# EAGLE design fingertip_20line_2 (EAGLE 9.6.2)
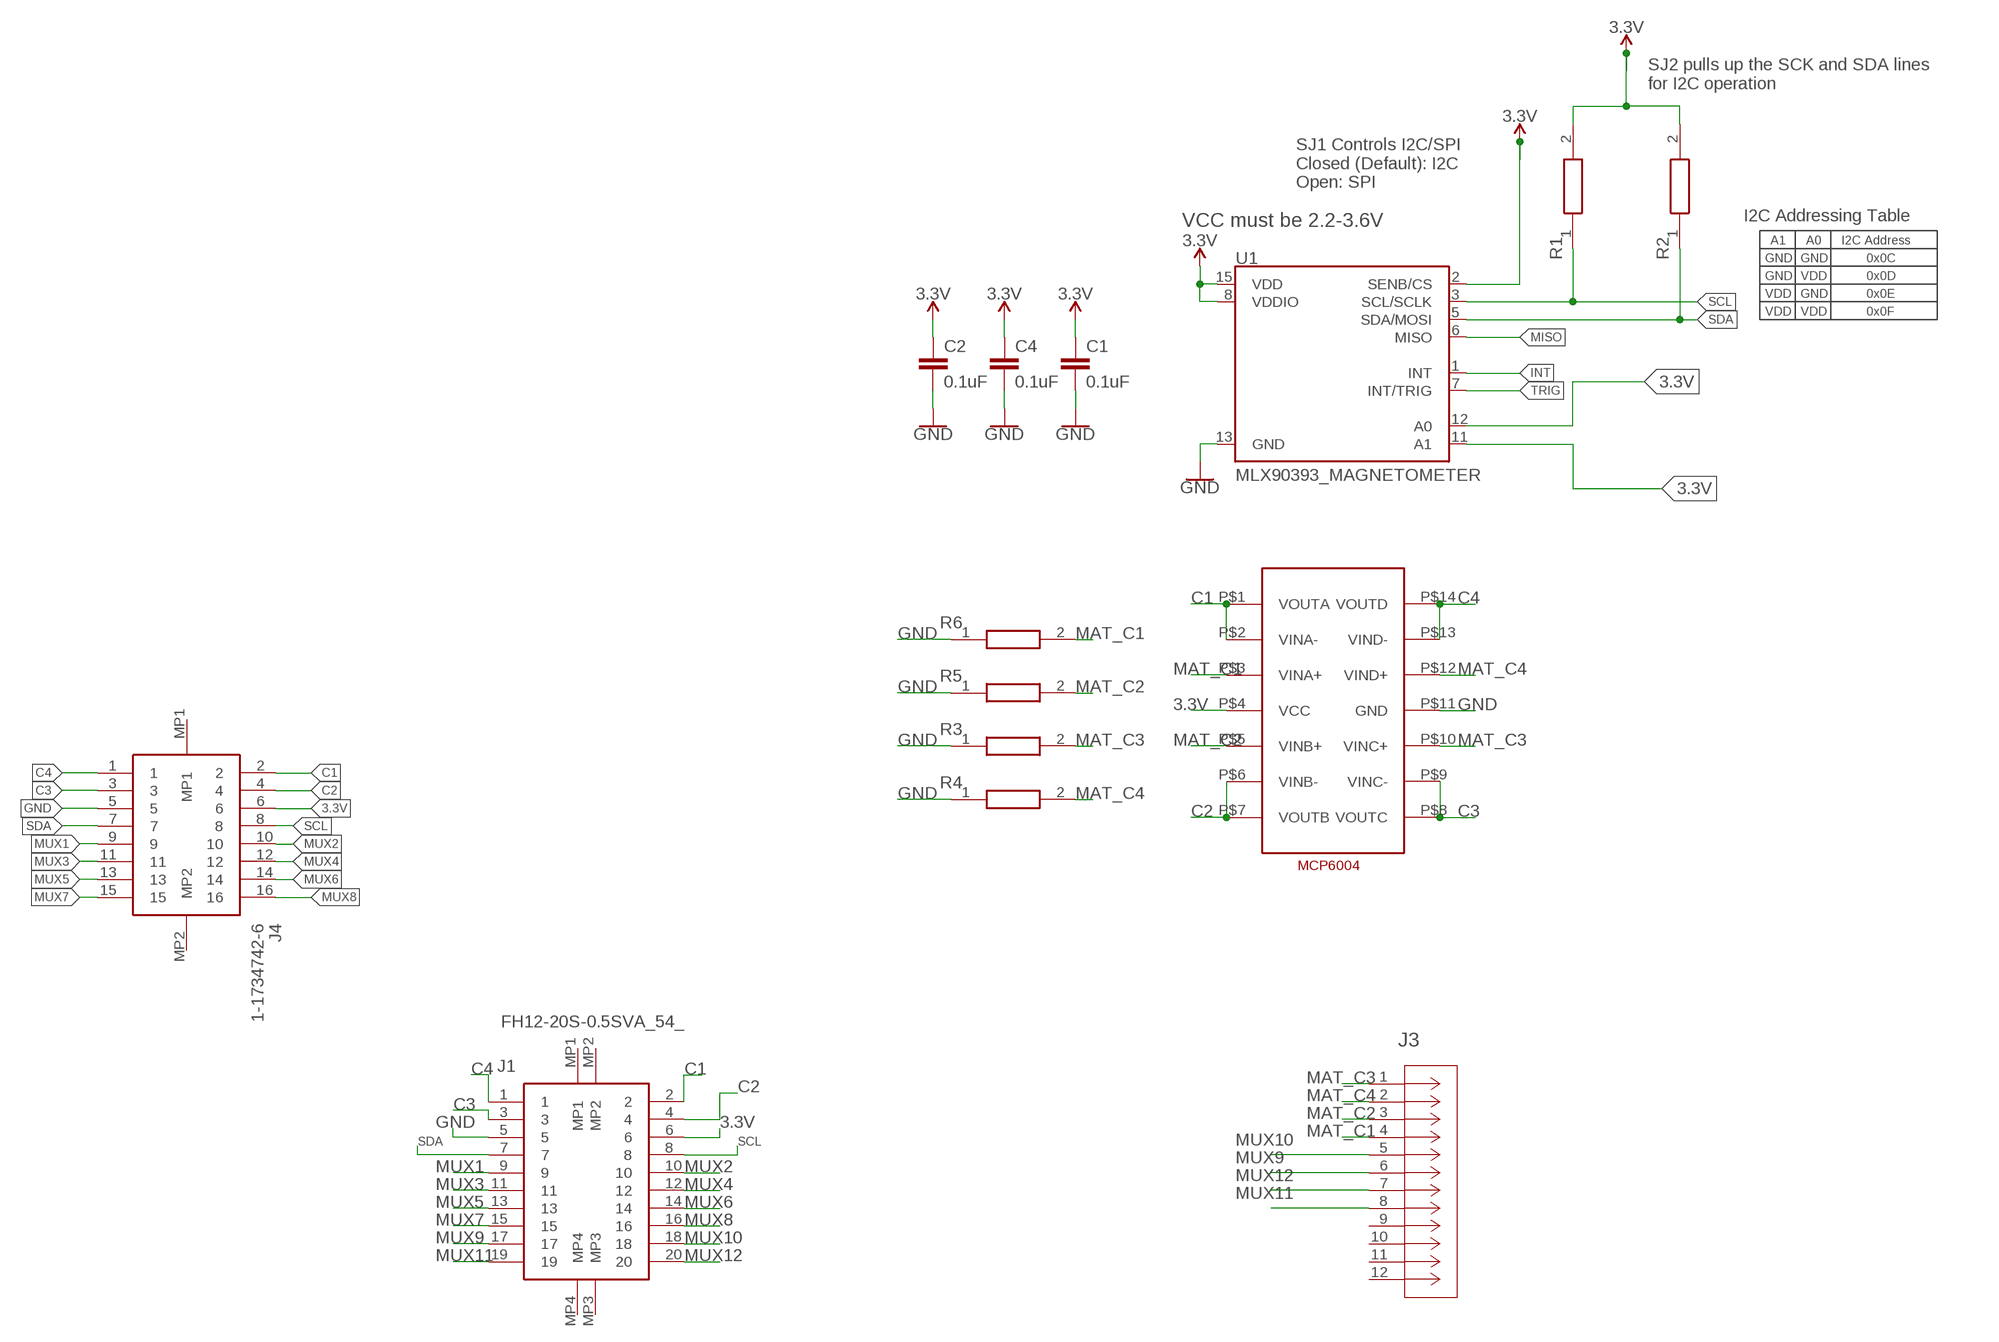
[diagram p0: schematic, sheet 1]

## Parts
C1  0.1uF  0.1UF-0603-25V-(+80/-20%)  [0603]
C2  0.1uF  0.1UF-0603-25V-(+80/-20%)  [0603]
C4  0.1uF  0.1UF-0603-25V-(+80/-20%)  [0603]
J1  FH12-20S-0.5SVA_54_  [FH1220S05SVA54]
J3  FH12-8S-1SV(55)  [CON8_1X8_DUTB1_HRS_HIR]
J4  1-1734742-6  [117347426]
R1  ERJ-S02J103X  [RESC1005X40N]
R2  ERJ-S02J103X  [RESC1005X40N]
R3  ERJ-S02J103X  [RESC1005X40N]
R4  ERJ-S02J103X  [RESC1005X40N]
R5  ERJ-S02J103X  [RESC1005X40N]
R6  ERJ-S02J103X  [RESC1005X40N]
U1  MLX90393_MAGNETOMETER  [QFN-16_WITH_AXIES]
U$2  DECADE-MCP6004  [DECADE-MCP6003]

## Nets
3.3V: C1.1 C2.1 C4.1 J1.6 J4.6 R1.2 R2.2 U1.2(SENB/CS) U1.8(VDDIO) U1.11(A1) U1.12(A0) U1.15(VDD) U$2.P$4(VCC)
C1: J1.2 J4.2 U$2.P$1(VOUTA) U$2.P$2(VINA-)
C2: J1.4 J4.4 U$2.P$6(VINB-) U$2.P$7(VOUTB)
C3: J1.3 J4.3 U$2.P$8(VOUTC) U$2.P$9(VINC-)
C4: J1.1 J4.1 U$2.P$13(VIND-) U$2.P$14(VOUTD)
GND: C1.2 C2.2 C4.2 J1.5 J4.5 R3.1 R4.1 R5.1 R6.1 U1.13(GND) U$2.P$11(GND)
INT: U1.1(INT)
MAT_C1: J3.4 R6.2 U$2.P$3(VINA+)
MAT_C2: J3.3 R5.2 U$2.P$5(VINB+)
MAT_C3: J3.1 R3.2 U$2.P$10(VINC+)
MAT_C4: J3.2 R4.2 U$2.P$12(VIND+)
MISO: U1.6(MISO)
MUX1: J1.9 J4.9
MUX2: J1.10 J4.10
MUX3: J1.11 J4.11
MUX4: J1.12 J4.12
MUX5: J1.13 J4.13
MUX6: J1.14 J4.14
MUX7: J1.15 J4.15
MUX8: J1.16 J4.16
MUX9: J1.17 J3.6
MUX10: J1.18 J3.5
MUX11: J1.19 J3.8
MUX12: J1.20 J3.7
SCL: J1.8 J4.8 R1.1 U1.3(SCL/SCLK)
SDA: J1.7 J4.7 R2.1 U1.5(SDA/MOSI)
TRIG: U1.7(INT/TRIG)
Unconnected: J1.MP1 J1.MP2 J1.MP3 J1.MP4 J3.9 J3.10 J3.11 J3.12 J4.MP1 J4.MP2

## Notes on the sheet
- SJ2 pulls up the SCK and SDA lines
  for I2C operation
- SJ1 Controls I2C/SPI
  Closed (Default): I2C
  Open: SPI
- VCC must be 2.2-3.6V
- I2C Addressing Table
- A1 | A0 | I2C Address
- GND | GND | 0x0C
- GND | VDD | 0x0D
- VDD | GND | 0x0E
- VDD | VDD | 0x0F

## Library data of the parts
C1 C2 C4 = SparkFun-Capacitors:0.1UF: 0.1µF ceramic capacitors A capacitor is a passive two-terminal electrical component used to store electrical energy temporarily in an electric field.; PROD_ID: CAP-00810
J1 = FH12-20S-0.5SVA_54_:FH12-20S-0.5SVA_54_: Hirose FH12 0.5mm Pitch 20 Way SMT Female FPC Connector, ZIF Vertical Contact Source: Datasheet <http://uk.rs-online.com/web/p/products/1760102P>; DESCRIPTION: Hirose FH12 0.5mm Pitch 20 Way SMT Female FPC Connector, ZIF Vertical Contact; HEIGHT: 5.7mm; MANUFACTURER_NAME: Hirose; MANUFACTURER_PART_NUMBER: FH12-20S-0.5SVA(54); RS_PART_NUMBER: 1760102P; RS_PRICE-STOCK: http://uk.rs-online.com/web/p/products/1760102P
J3 = my-library:FH12-8S-1SV(55); BUILT_BY: EMA_Kyle; COPYRIGHT: Copyright (C) 2018 Accelerated Designs. All rights reserved; MANUFACTURER_PART_NUMBER: FH12-8S-1SV(55); SOURCELIBRARY: Hirose_2008-01-01; VENDOR: Hirose
J4 = SamacSys_Parts:1-1734742-6: TE CONNECTIVITY - 1-1734742-6 - CONNECTOR, FFC / FPC, 0.5MM, 16WAY Source: Datasheet <https://www.te.com/commerce/DocumentDelivery/DDEController?Action=showdoc&DocId=Customer Drawing1734742PpdfEnglishENG_CD_1734742_P.pdf1-1734742-6>; DESCRIPTION: TE CONNECTIVITY - 1-1734742-6 - CONNECTOR, FFC / FPC, 0.5MM, 16WAY; HEIGHT: 5.3mm; MANUFACTURER_NAME: TE Connectivity; MANUFACTURER_PART_NUMBER: 1-1734742-6; MOUSER_PART_NUMBER: 571-1-1734742-6; MOUSER_PRICE-STOCK: https://www.mouser.co.uk/ProductDetail/TE-Connectivity/1-1734742-6?qs=GQ3BsEl46pkEaYiPSkWN4w%3D%3D
R1-R6 = SamacSys_Parts:ERJ-S02J103X: Thick Film Resistors - SMD 0402 10Kohms 5% Anti-Sulfur Source: Datasheet <https://industrial.panasonic.com/cdbs/www-data/pdf/RDP0000/AOA0000C334.pdf>; DESCRIPTION: Thick Film Resistors - SMD 0402 10Kohms 5% Anti-Sulfur; HEIGHT: 0.4mm; MANUFACTURER_NAME: Panasonic; MANUFACTURER_PART_NUMBER: ERJ-S02J103X
U1 = SparkFun-Sensors:MLX90393_MAGNETOMETER; PROD_ID: SEN-13886
U$2 = DECADE-libraries20151104:DECADE-MCP6004

## Board
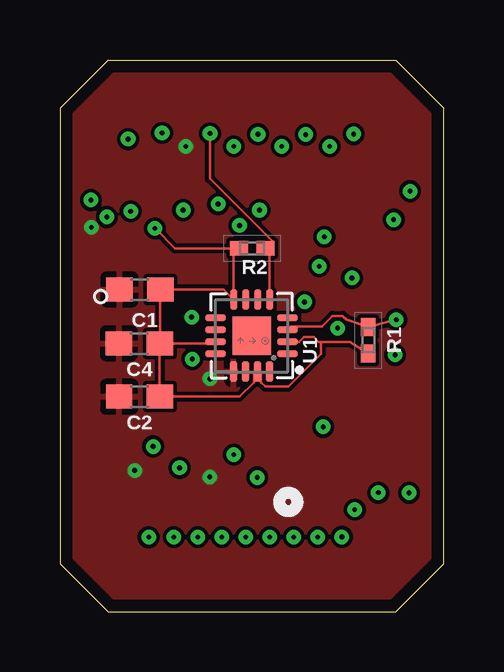
[diagram p1: board, top side]
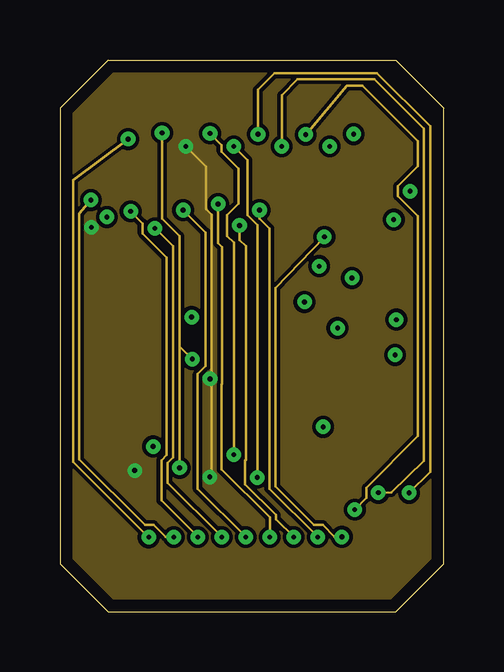
[diagram p2: board, inner layer Route2]
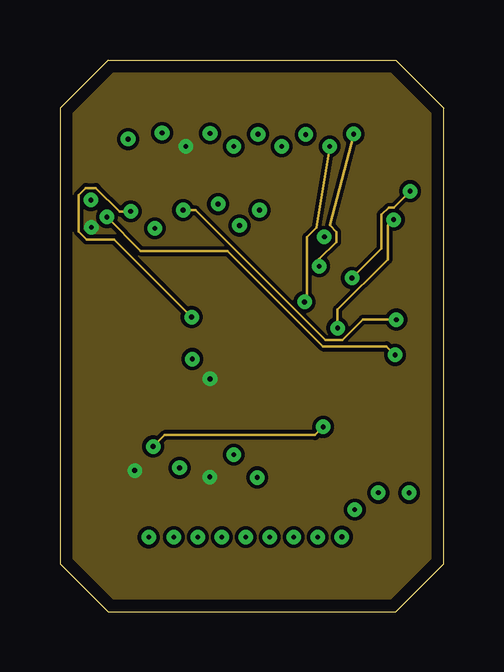
[diagram p3: board, inner layer Route15]
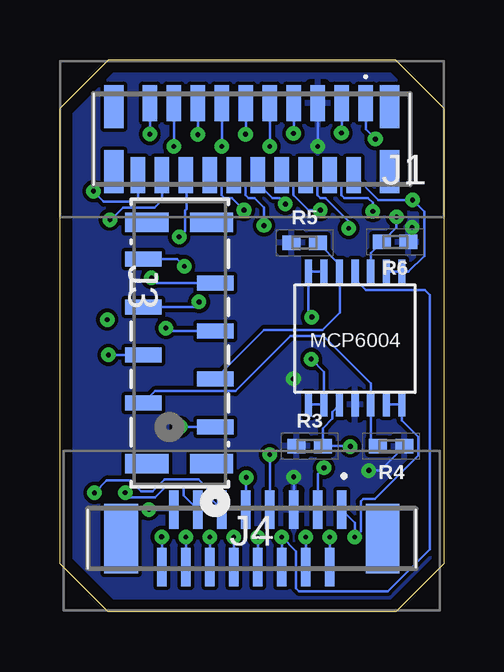
[diagram p4: board, bottom side, seen from below]

Size 16 x 23 mm. Coordinates in mm from the lower left corner, seen from the top.
Outline: 2,23 14,23 16,21 16,2 14,0 2,0 0,2 0,21 2,23
Copper layers (1+2*15+16): Top 0.035mm / dielectric 0.2mm / Route2 0.0175mm / dielectric 1.065mm / Route15 0.0175mm / dielectric 0.2mm / Bottom 0.035mm
Design rules "default *": minimum track width 0.1mm, minimum drill 0.2mm, track to track 6mil, track to pad 6mil, pad to pad 6mil, via to via 6mil, smd to smd 6mil, copper to edge 20mil, drill to drill 6mil, minimum pad ring 10mil, minimum via ring 8mil, stop-mask expansion 4mil, vias tented up to drill 0mil, thermal gap 10mil

### Footprints (pad centres in the part's own frame; a part is rotated, then mirrored left to right if it is on the bottom)
0603 = smd 1.1 x 1: 1 -0.85,0; 2 0.85,0
FH1220S05SVA54 = smd 0.6 x 1.5: 1 4.75,1.5; 2 4.25,-1.5; 3 3.75,1.5; 4 3.25,-1.5; 5 2.75,1.5; 6 2.25,-1.5; 7 1.75,1.5; 8 1.25,-1.5; 9 0.75,1.5; 10 0.25,-1.5; 11 -0.25,1.5; 12 -0.75,-1.5; 13 -1.25,1.5; 14 -1.75,-1.5; 15 -2.25,1.5; 16 -2.75,-1.5; 17 -3.25,1.5; 18 -3.75,-1.5; 19 -4.25,1.5; 20 -4.75,-1.5 | smd 0.8 x 1.8: MP1 5.75,1.35; MP2 5.75,-1.35; MP3 -5.75,-1.35; MP4 -5.75,1.35
CON8_1X8_DUTB1_HRS_HIR = smd 0.61 x 1.524: 1 3.5,1.473; 2 2.5,-1.524; 3 1.5,1.473; 4 0.5,-1.524; 5 -0.5,1.473; 6 -1.5,-1.524; 7 -2.5,1.473; 8 -3.5,-1.524 | smd 0.813 x 1.803: 9 -5.029,-1.372; 10 5.029,-1.372; 11 -5.029,1.321; 12 5.029,1.321
117347426 = smd 0.4 x 1.6: 1 -3.75,-1.2; 2 -3.25,1.2; 3 -2.75,-1.2; 4 -2.25,1.2; 5 -1.75,-1.2; 6 -1.25,1.2; 7 -0.75,-1.2; 8 -0.25,1.2; 9 0.25,-1.2; 10 0.75,1.2; 11 1.25,-1.2; 12 1.75,1.2; 13 2.25,-1.2; 14 2.75,1.2; 15 3.25,-1.2; 16 3.75,1.2 | smd 1.4 x 2.9: MP1 -5.45,0; MP2 5.45,0
RESC1005X40N = smd 0.75 x 0.6: 1 -0.55,0; 2 0.55,0
QFN-16_WITH_AXIES = smd 0.3 x 0.85: 1 0.754,1.498; 2 0.254,1.498; 3 -0.246,1.498; 4 -0.746,1.498; 9 -0.746,-1.506; 10 -0.246,-1.506; 11 0.254,-1.506; 12 0.754,-1.506 | smd 0.85 x 0.3: 5 -1.508,0.746; 6 -1.508,0.246; 7 -1.508,-0.254; 8 -1.508,-0.754; 13 1.496,-0.764; 14 1.496,-0.264; 15 1.496,0.236; 16 1.496,0.736 | smd 1.6 x 1.6: 17 0,0
DECADE-MCP6003 = smd 1 x 0.3: P$1 2.75,-2.05; P$2 2.75,-1.4; P$3 2.75,-0.75; P$4 2.75,-0.1; P$5 2.75,0.55; P$6 2.75,1.2; P$7 2.75,1.85; P$8 -2.8,1.85; P$9 -2.8,1.2; P$10 -2.8,0.55; P$11 -2.8,-0.1; P$12 -2.8,-0.75; P$13 -2.8,-1.4; P$14 -2.8,-2.05

### Placement (x,y rotation side)
C1  3.33,13.43 180 top
C2  3.32,8.96 180 top
C4  3.31,11.18 180 top
J1  8,19.7 0 bottom
J3  11,11.2 270 bottom
J4  8,3.05 180 bottom
R1  12.86,11.32 270 top
R2  8.02,15.14 180 top
R3  5.59,6.9 0 bottom
R4  2.18,6.89 180 bottom
R5  5.8,15.38 0 bottom
R6  2.02,15.41 180 bottom
U1  8,11.5 270 top
U$2  3.79,11.43 90 bottom

### Tracks (layer width: path | path; a pad name or v marks a point on that pad's centre or on a via)
3.3V  (via drill 0.2)
  Top 0.102: R1.2 12.08,11.25 10.89,11.25 | U1.2 9.97,11.25 10.17,11.45 10.59,11.45 10.79,11.25 10.89,11.25 | 10.89,11.25 10.88,11.24 10.88,10.73 9.53,9.38 8.57,9.38 8.38,9.56 8.38,9.86 U1.15 8.09,9.86 8.09,9.56 7.49,8.96 C2.1 C4.1 | U1.12 U1.11 6.43,11.18 C4.1 | v3.96,15.98 4.8,15.14 R2.2 7.25,14.92 U1.8 6.82,13.43 C1.1 4.18,11.2 C4.1
  Route2 0.102: v6.75,3.11 4.48,5.37 4.48,6.2 4.71,6.43 4.71,15.23 v3.96,15.98
  Bottom 0.1: U$2.P$4 3.69,13.87 3.23,13.41 0.78,13.41 0.56,13.19 0.56,2.6 2.32,0.85 6.03,0.85 6.15,0.97 6.15,2.51 v6.75,3.11
  Bottom 0.102: J1.6 5.25,17.7 5.25,17.37 5.13,17.25 4.93,17.25 3.96,16.28 v3.96,15.98 | J4.6 v6.75,3.11
C1  (via drill 0.2)
  Route2 0.1: v4.75,3.11 4.42,3.11 3.92,3.61 3.56,3.61 0.81,6.35 0.81,16.59 v1.29,17.16
  Bottom 0.102: J1.2 2.71,17.16 v1.29,17.16 0.81,16.68 0.81,14.83 1.46,14.18 U$2.P$1 U$2.P$2 | J4.2 v4.75,3.11
C2  (via drill 0.2)
  Route2 0.102: v5.75,3.11 4.23,4.63 4.23,6.31 4.46,6.54 4.46,14.77 3.45,15.77 3.45,16.18 v2.95,16.69
  Route15 0.102: v5.5,12.28 2.26,15.51 1.11,15.51 0.78,15.84 0.78,17.37 1.08,17.67 1.5,17.67 2.48,16.69 v2.95,16.69
  Bottom 0.102: J1.4 4.25,17.7 4.25,17.37 4.13,17.25 3.16,17.25 2.95,17.04 v2.95,16.69 | J4.4 v5.75,3.11 | U$2.P$6 U$2.P$7 5.64,12.42 v5.5,12.28
C3  (via drill 0.2)
  Route2 0.1: v4.26,19.96 4.26,16.39 4.99,15.66 4.99,11.08 v4.99,5.99
  Route2 0.102: v5.52,10.53 4.99,11.06 4.99,11.08
  Bottom 0.102: J1.3 v4.25,19.97 v4.26,19.96 | J4.3 5.25,5.73 v4.99,5.99 | U$2.P$8 U$2.P$9 4.99,10 v5.52,10.53
C4  (via drill 0.2)
  Route2 0.1: v3.71,3.1 0.56,6.25 0.56,17.99 v2.84,19.7
  Bottom 0.102: J1.1 3.25,20.11 v2.84,19.7 | J4.1 3.71,3.71 v3.71,3.1 3.45,3.35 3.45,4.58 3.33,4.7 2.85,4.7 1.05,6.51 1.05,7.27 1.74,7.96 U$2.P$14 U$2.P$13
GND  (via drill 0.2)
  Top 0.102: U1.13 6.56,10 v6.26,9.7
  Route2 0.102: v6.25,5.61 6.33,5.69 6.33,16.55 6.09,16.79 6.09,18.55 v5.25,19.39
  Bottom 0.1: v6.25,5.61 J4.5
  Bottom 0.102: J1.5 v5.25,19.39 | R6.1 1.32,15.56 v1.32,16.02 | R4.1 2.64,5.88 v3.12,5.88
  pour Bottom: -0.29,23.76 -0.29,-0.74 16.28,-0.74 16.28,23.76
  pour Top: -0.48,24.04 16.55,24.04 16.55,-0.78 -0.48,-0.78
  pour Route2: -0.32,23.93 -0.39,-0.79 16.18,-0.65 16.41,23.9
  pour Route15: -0.35,23.76 -0.32,-0.53 16.39,-0.49 16.46,23.77
MAT_C1  (via drill 0.2)
  Route15 0.102: v1.96,16.45 3.37,15.04 7,15.04 10.98,11.06 13.62,11.06 v13.98,10.7
  Bottom 0.102: U$2.P$3 3.04,14.94 R6.2 1.96,16.02 v1.96,16.45 | J3.4 v13.98,10.7
MAT_C2
  Bottom 0.102: R5.2 4.34,14.47 U$2.P$5 4.33,14.17 4.33,12.47 5.05,11.74 7.49,11.74 J3.3
MAT_C3  (via drill 0.2)
  Route15 0.102: v10.98,7.7 10.64,7.36 4.37,7.36 v3.89,6.88
  Bottom 0.102: U$2.P$10 4.64,8.33 4.64,8.05 5.04,7.64 R3.2 3.91,6.9 v3.89,6.88 | J3.1 v10.98,7.7
MAT_C4
  Bottom 0.102: R4.2 3.04,7.2 U$2.P$12 3.04,9.51 5.02,11.49 6.39,11.49 8.68,9.19 12.03,9.19 J3.2
MUX1  (via drill 0.2)
  Route2 0.102: v8.23,5.59 8.23,16.12 7.82,16.53 7.82,18.83 v7.25,19.39
  Bottom 0.1: J4.9 v8.23,5.59
  Bottom 0.102: J1.9 v7.25,19.39
MUX2  (via drill 0.2)
  Route2 0.102: v6.6,16.99 6.6,15.36 6.77,15.19 6.77,9.49 6.74,9.47 6.74,5.93 8.75,3.92 v8.75,3.11
  Bottom 0.102: v6.6,16.99 6.85,17.25 7.13,17.25 7.75,17.86 J1.10 | J4.10 v8.75,3.11
MUX3  (via drill 0.2)
  Route2 0.102: v8.26,19.9 8.26,21.76 8.94,22.44 13.23,22.44 15.44,20.23 15.44,5.83 v14.56,4.95
  Bottom 0.102: J1.11 v8.25,19.91 v8.26,19.9 | J4.11 9.85,4.85 9.85,5.13 10.22,5.51 11.64,5.51 12.14,5.01 12.62,5.01 13.07,5.46 14.05,5.46 v14.56,4.95
MUX4  (via drill 0.2)
  Route2 0.102: v9.75,3.11 9,3.85 9,4.03 7.72,5.31 7.72,6.3 7.76,6.33 7.76,15.23 7.49,15.5 v7.49,16.1
  Bottom 0.102: J1.12 8.25,17.7 8.25,17.37 8.13,17.25 7.89,17.25 7.49,16.85 v7.49,16.1 | J4.12 v9.75,3.11
MUX5  (via drill 0.2)
  Route2 0.1: v9.25,19.39 9.25,21.53 9.91,22.19 13.12,22.19 15.19,20.12 15.19,6.29 13.83,4.97 v13.28,4.96
  Bottom 0.102: J1.13 v9.25,19.39 | J4.13 10.85,4.85 10.85,5.13 10.97,5.25 11.53,5.25 12.03,4.76 13.08,4.76 v13.28,4.96
MUX6  (via drill 0.2)
  Route2 0.102: v8.32,16.74 8.32,16.38 8.74,15.97 8.74,5.12 v10.75,3.11
  Bottom 0.102: J1.14 9.25,17.7 9.25,17.37 9.13,17.25 8.83,17.25 v8.32,16.74 | J4.14 v10.75,3.11
MUX7  (via drill 0.2)
  Route2 0.1: v12.29,4.25 12.77,4.73 12.77,5.17 14.93,7.33 14.93,16.49 14.1,17.32 14.1,17.74 14.93,18.57 14.93,19.62 12.62,21.94 11.96,21.94 v10.25,19.89
  Bottom 0.102: J1.15 v10.25,19.89 | J4.15 v12.29,4.25
MUX8  (via drill 0.2)
  Route2 0.1: v11.76,3.11 11.46,3.11 10.96,3.61 10.6,3.61 8.99,5.22 8.99,13.49 v11.03,15.62
  Bottom 0.102: J1.16 10.73,18.18 10.73,16.78 10.78,16.72 10.78,15.86 v11.03,15.62 | J4.16 v11.75,3.11 v11.76,3.11
MUX9  (via drill 0.2)
  Route15 0.1: v11.25,19.39 10.7,16.02 10.3,15.62 10.3,13.01 v10.2,12.91
  Bottom 0.102: J1.17 v11.25,19.39 | J3.6 10.41,12.7 v10.2,12.91
MUX10  (via drill 0.2)
  Route15 0.1: v13.92,16.34 13.67,16.09 13.67,14.68 11.58,12.6 v11.58,11.82
  Bottom 0.102: J1.18 11.75,17.15 12.06,16.84 13.36,16.84 13.86,16.34 v13.92,16.34 | J3.5 11.46,11.7 v11.58,11.82
MUX11  (via drill 0.2)
  Route15 0.1: v12.25,19.91 11.26,16.11 11.53,15.83 11.53,15.41 10.81,14.69 v10.81,14.4
  Bottom 0.102: J1.19 v12.25,19.91 | J3.8 11.11,14.7 v10.81,14.4
MUX12  (via drill 0.2)
  Route15 0.1: v12.18,13.91 13.41,15.14 13.41,16.55 13.71,16.85 13.92,16.85 v14.61,17.53
  Bottom 0.102: J1.20 12.75,17.24 12.9,17.09 14.17,17.09 v14.61,17.53 | J3.7 11.97,13.7 v12.18,13.91
SCL  (via drill 0.2)
  Top 0.102: U1.3 9.64,11.89 10.94,11.89 11.37,12.33 11.79,12.33 11.95,12.17 R1.1 v14.03,12.17
  Route2 0.102: v7.75,3.11 5.74,5.11 5.74,9.9 6.08,10.23 6.08,15.8 v5.14,16.74
  Route15 0.1: v14.03,12.17 12.64,12.17 11.79,11.31 11.08,11.31 5.65,16.74 v5.14,16.74
  Bottom 0.102: J1.8 6.25,17.7 6.25,17.37 5.63,16.74 v5.14,16.74 | J4.8 v7.75,3.11
SDA  (via drill 0.2)
  Top 0.102: U1.5 8.75,15.02 R2.1 8.87,15.44 6.26,18.05 v6.26,19.94
  Route2 0.102: v6.26,19.94 6.74,19.46 6.74,19.18 7.45,18.47 7.45,17.02 6.97,16.54 6.97,15.66 7.25,15.38 v7.25,6.54
  Bottom 0.102: J1.7 v6.25,19.95 v6.26,19.94 | J4.7 v7.25,6.54